# Altium project DieuKhien.PrjPcb
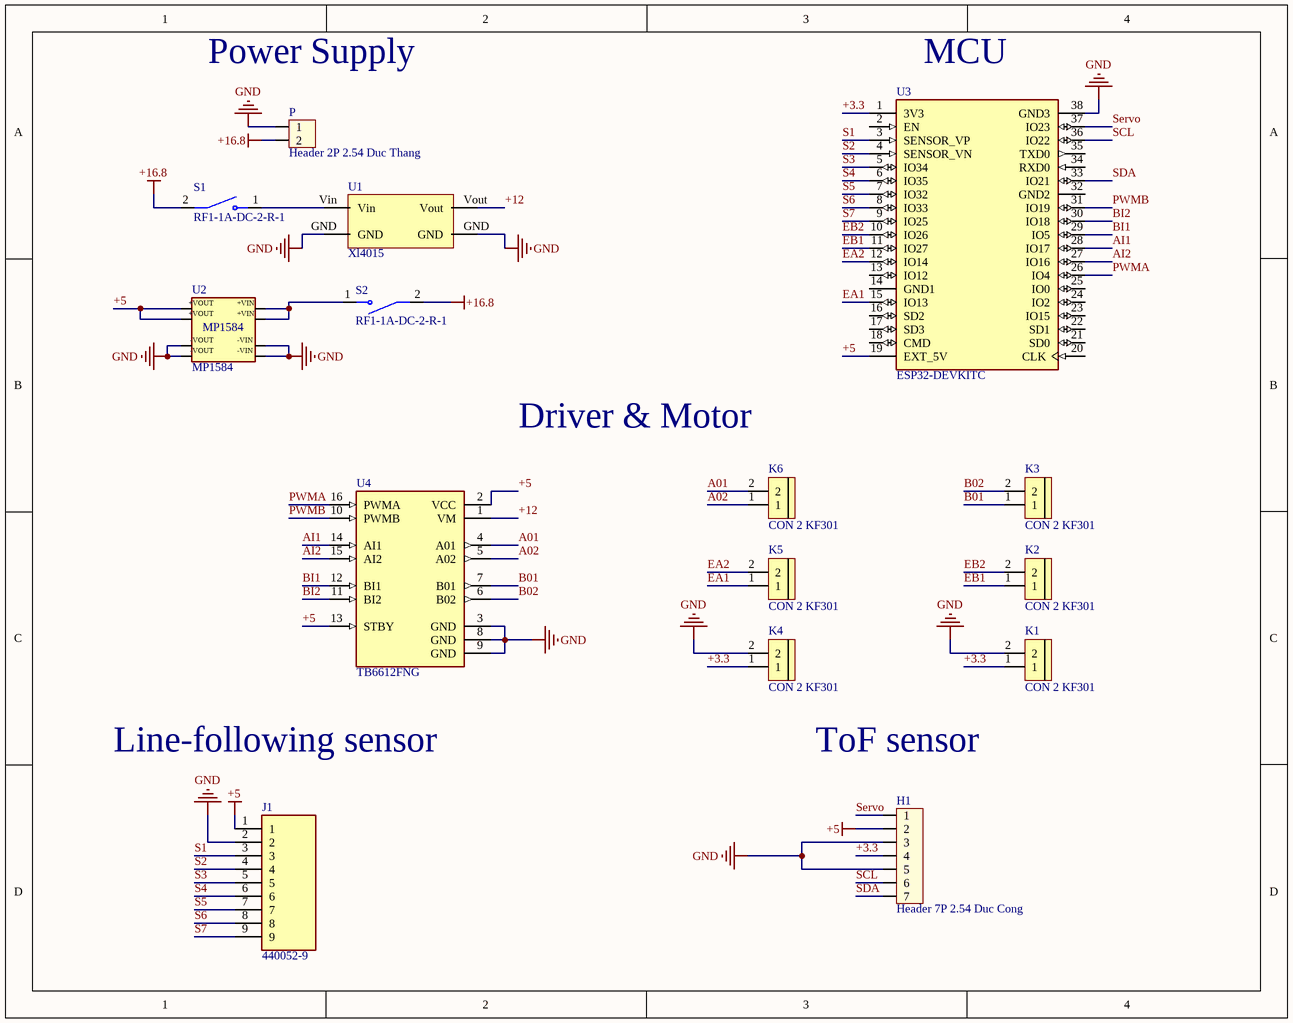
[diagram p0: DieuKhien_schematic.SchDoc]
1 sheet, 15 parts. Net scope: global (net labels, ports and power ports of the same name join across sheets).
Board file: DieuKhien_PCB.PcbDoc

## Sheet DieuKhien_schematic.SchDoc
size A; SheetNumber: 1; SheetTotal: 1

### Parts
H1  Header 7P 2.54 Duc Cong  [Header 7P DC 2.54]
J1  440052-9  [TE_440052-9]
K1  CON 2 KF301  [Con 2 KF301 5.08]
K2  CON 2 KF301  [Con 2 KF301 5.08]
K3  CON 2 KF301  [Con 2 KF301 5.08]
K4  CON 2 KF301  [Con 2 KF301 5.08]
K5  CON 2 KF301  [Con 2 KF301 5.08]
K6  CON 2 KF301  [Con 2 KF301 5.08]
P  Header 2P 2.54 Duc Thang  [XH2.54M-2]
S1  RF1-1A-DC-2-R-1  [SW_RF1-1A-DC-2-R-1]
S2  RF1-1A-DC-2-R-1  [SW_RF1-1A-DC-2-R-1]
U1  Xl4015  [XL4015]
U2  MP1584  [MP1584]
U3  ESP32-DEVKITC  [MODULE_ESP32-DEVKITC]
U4  TB6612FNG  [MODULE_ROB-14450]

### Nets
+5: H1.2 J1.1 U2.+VOUT U3.19(EXT_5V) U4.2(VCC) U4.13(STBY)
+16.8: P.2 S1.2 S2.2
GND: H1.3 H1.5 J1.2 K1.2 K4.2 P.1 U1.GND U2.-VIN U2.-VOUT U3.38(GND3) U4.3(GND) U4.8(GND) U4.9(GND)
+3.3: H1.4 K1.1 K4.1 U3.1(3V3)
+12: U1.Vout U4.1(VM)
A01: K6.2 U4.4(A01)
A02: K6.1 U4.5(A02)
AI1: U3.28(IO17) U4.14(AI1)
AI2: U3.27(IO16) U4.15(AI2)
B01: K3.1 U4.7(B01)
B02: K3.2 U4.6(B02)
BI1: U3.29(IO5) U4.12(BI1)
BI2: U3.30(IO18) U4.11(BI2)
EA1: K5.1 U3.15(IO13)
EA2: K5.2 U3.12(IO14)
EB1: K2.1 U3.11(IO27)
EB2: K2.2 U3.10(IO26)
PWMA: U3.26(IO4) U4.16(PWMA)
PWMB: U3.31(IO19) U4.10(PWMB)
S1: J1.3 U3.3(SENSOR_VP)
S2: J1.4 U3.4(SENSOR_VN)
S3: J1.5 U3.5(IO34)
S4: J1.6 U3.6(IO35)
S5: J1.7 U3.7(IO32)
S6: J1.8 U3.8(IO33)
S7: J1.9 U3.9(IO25)
SCL: H1.6 U3.36(IO22)
SDA: H1.7 U3.33(IO21)
Servo: H1.1 U3.37(IO23)
NetS1_1: S1.1 U1.Vin
NetS2_1: S2.1 U2.+VIN

Not connected (* = marked no-connect by the designer): U3 2(EN) 13(IO12) 14(GND1) 16(SD2) 17(SD3) 18(CMD) 20(CLK) 21(SD0) 22(SD1) 23(IO15) 24(IO2) 25(IO0) 32(GND2) 34(RXD0) 35(TXD0)

### Notes on the sheet
- Power Supply
- (near U3) MCU
- Driver & Motor
- Line-following sensor
- ToF sensor

### Library data of the parts
H1 = Header 7P 2.54 Duc Cong: Cắm; Ten_Linh_Kien: Header 7P XH2.54-7P Đực Cong; Don_Vi: Con; Ma_Hang: MH004118; Chung_Loai: Cắm
K1-K6 = CON 2 KF301: Cắm; Ma_Hang: MH000987; Ten_Linh_Kien: CON 2 KF301-2P 5.08MM Xanh Dương; Chung_Loai: Cắm; Ghi_Chu: *; Kieu_Chan: *; Don_Vi: Con
P = Header 2P 2.54 Duc Thang: Cắm; Ten_Linh_Kien: Header 2P XH2.54-2P Đực Thẳng; Don_Vi: Con; Ma_Hang: MH001283; Chung_Loai: Cắm
S1 S2 = RF1-1A-DC-2-R-1: Switch, Mini Rocker, 2P SPST OFF-ON, Red w/ Print, VDC | Switch Components RF1-1A-DC-2-R-1; SnapEDA_Link: https://www.snapeda.com/parts/RF1-1A-DC-2-R-1/Switch+Components/view-part/?ref=snap; Package: None; Value: *; MF: Switch Components; MP: RF1-1A-DC-2-R-1; Check_prices: https://www.snapeda.com/parts/RF1-1A-DC-2-R-1/Switch+Components/view-part/?ref=eda
U3 = ESP32-DEVKITC: ESP32-WROOM-32UE series Transceiver; 802.11 b/g/n (Wi-Fi, WiFi, WLAN), Bluetooth Â® Smart Ready 4.x Dual Mode Evaluation Board; MF: Espressif Systems; SnapEDA_Link: https://www.snapeda.com/parts/ESP32-DEVKITC/Espressif+Systems/view-part/?ref=snap; Package: None; Value: *; MP: ESP32-DEVKITC; Check_prices: https://www.snapeda.com/parts/ESP32-DEVKITC/Espressif+Systems/view-part/?ref=eda
U4 = ROB-14450: TB6612FNG Motor Controller/Driver Power Management Evaluation Board; MF: SparkFun Electronics; Check_prices: https://www.snapeda.com/parts/ROB-14450/SparkFun%20Electronics/view-part/2656367/?ref=eda; Package: None; MP: ROB-14450; Value: *; Availability: In Stock; SnapEDA_Link: https://www.snapeda.com/parts/ROB-14450/SparkFun%20Electronics/view-part/2656367/?ref=snap; Price: None
J1 = 440052-9: Package: None; Price: None; Value: *; MP: 440052-9; Availability: Unavailable